# Altium schematic sheet CC_amplifier.SchDoc
size A4; SheetNumber: 2; SheetTotal: 12
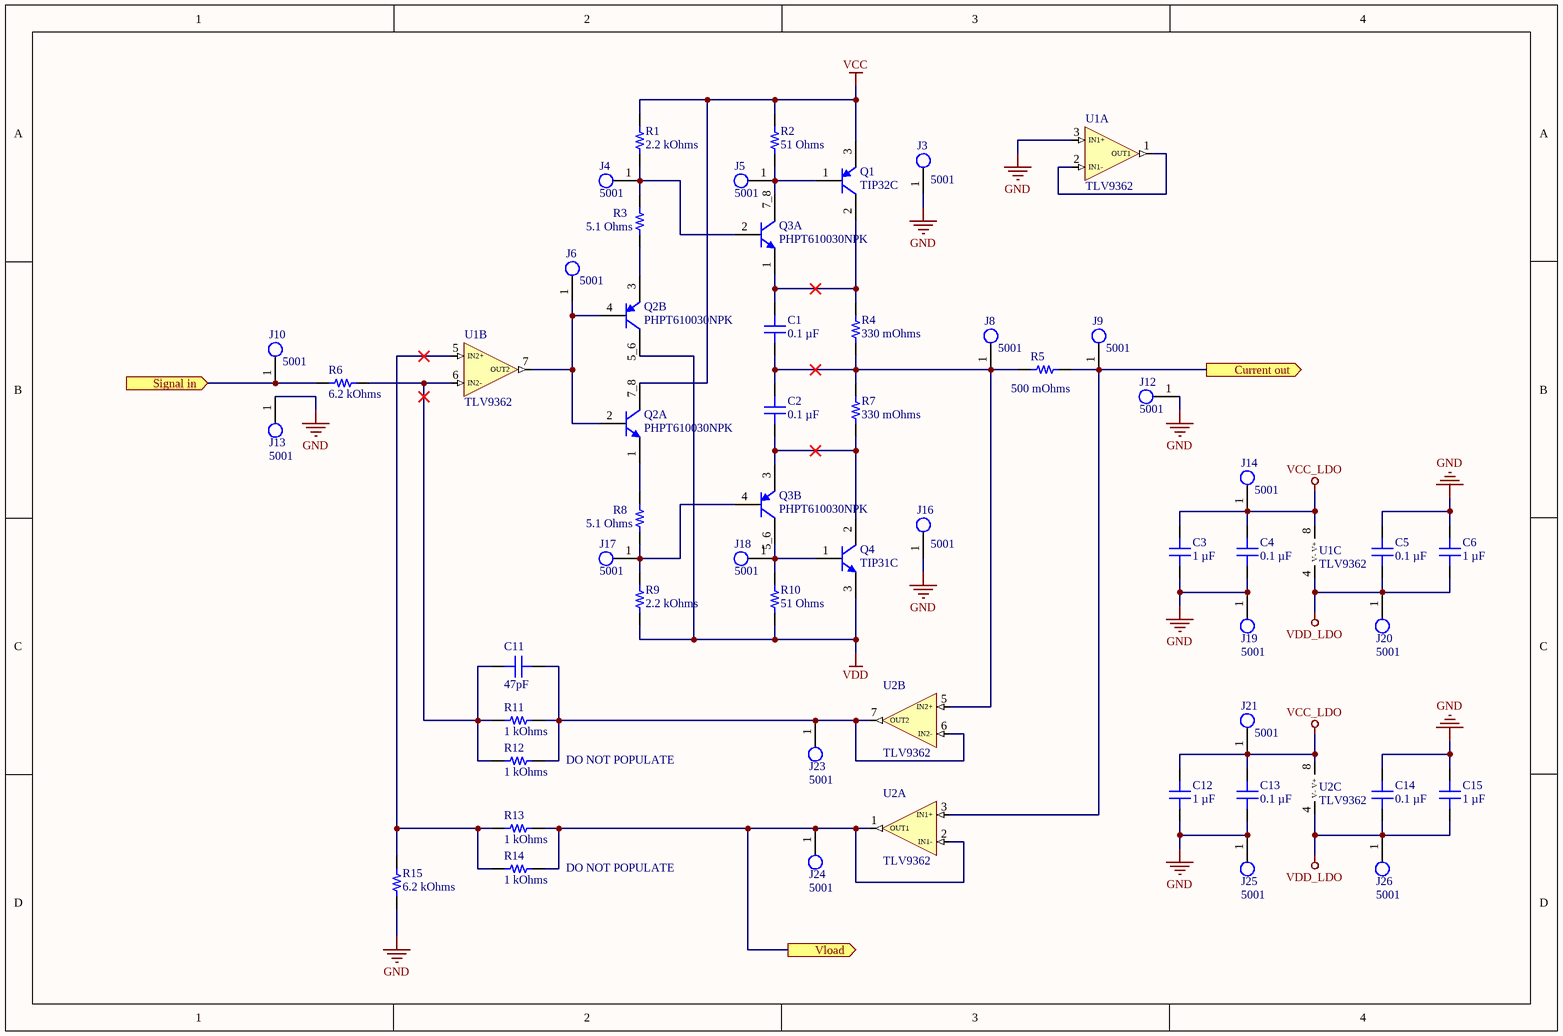
[diagram p0: CC_amplifier.SchDoc]

## Parts
C1  0.1 µF  [CAP 1206_3216 - 0.8MM]
C2  0.1 µF  [CAP 1206_3216 - 0.8MM]
C3  1 µF  [CAP 1206_3216 - 0.8MM]
C4  0.1 µF  [CAP 1206_3216 - 0.8MM]
C5  0.1 µF  [CAP 1206_3216 - 0.8MM]
C6  1 µF  [CAP 1206_3216 - 0.8MM]
C11  47pF  [CAP 1206_3216 - 1.8MM]
C12  1 µF  [CAP 1206_3216 - 0.8MM]
C13  0.1 µF  [CAP 1206_3216 - 0.8MM]
C14  0.1 µF  [CAP 1206_3216 - 0.8MM]
C15  1 µF  [CAP 1206_3216 - 0.8MM]
J3  5001  [FP-5001-MFG]
J4  5001  [FP-5001-MFG]
J5  5001  [FP-5001-MFG]
J6  5001  [FP-5001-MFG]
J8  5001  [FP-5001-MFG]
J9  5001  [FP-5001-MFG]
J10  5001  [FP-5001-MFG]
J12  5001  [FP-5001-MFG]
J13  5001  [FP-5001-MFG]
J14  5001  [FP-5001-MFG]
J16  5001  [FP-5001-MFG]
J17  5001  [FP-5001-MFG]
J18  5001  [FP-5001-MFG]
J19  5001  [FP-5001-MFG]
J20  5001  [FP-5001-MFG]
J21  5001  [FP-5001-MFG]
J23  5001  [FP-5001-MFG]
J24  5001  [FP-5001-MFG]
J25  5001  [FP-5001-MFG]
J26  5001  [FP-5001-MFG]
Q1  TIP32C  [ONSC-TO-220-3-221A-09]
Q2  PHPT610030NPK  [TRANS_BUK9K18-40E,115]  (parts A,B of 2)
Q3  PHPT610030NPK  [TRANS_BUK9K18-40E,115]  (parts A,B of 2)
Q4  TIP31C  [ONSC-TO-220-3-221A-09]
R1  2.2 kOhms  [RES 1206_3216]
R2  51 Ohms  [RES 1206_3216]
R3  5.1 Ohms  [RES 1206_3216]
R4  330 mOhms  [STACKPOLE CSR2512]
R5  500 mOhms  [STACKPOLE CSR2512]
R6  6.2 kOhms  [RES 1206_3216]
R7  330 mOhms  [STACKPOLE CSR2512]
R8  5.1 Ohms  [RES 1206_3216]
R9  2.2 kOhms  [RES 1206_3216]
R10  51 Ohms  [RES 1206_3216]
R11  1 kOhms  [RES 1206_3216]
R12  1 kOhms  [RES 1206_3216]
R13  1 kOhms  [RES 1206_3216]
R14  1 kOhms  [RES 1206_3216]
R15  6.2 kOhms  [RES 1206_3216]
U1  TLV9362  [SOIC8-127P600X175-8N]  (parts A,B,C of 3)
U2  TLV9362  [SOIC8-127P600X175-8N]  (parts A,B,C of 3)

## Ports
Current out (out), Signal in (in), Vload (out)

## Nets
GND: C3.1 C4.1 C5.2 C6.2 C12.1 C13.1 C14.2 C15.2 J3.1 J12.1 J13.1 J16.1 J19.1 J25.1 R15.1 U1.3(IN1+)
VCC: Q1.3(E) Q2.7_8(C1) R1.2 R2.2
VCC_LDO: C3.2 C4.2 C12.2 C13.2 J14.1 J21.1 U1.8(V+) U2.8(V+)
VDD: Q2.5_6(C2) Q4.3(E) R9.1 R10.1
VDD_LDO: C5.1 C6.1 C14.1 C15.1 J20.1 J26.1 U1.4(V-) U2.4(V-)
Current out: J9.1 R5.1 U2.3(IN1+) ; port Current out
Signal in: J10.1 R6.2 ; port Signal in
Vload: J24.1 R13.2 R14.2 U2.1(OUT1) U2.2(IN1-) ; port Vload
NetC1_1: C1.1 C2.2 J8.1 R4.1 R5.2 R7.2 U2.5(IN2+)
NetC1_2: C1.2 Q1.2(C) Q3.1(E1) R4.2
NetC2_1: C2.1 Q3.3(E2) Q4.2(C) R7.1
NetC11_1: C11.1 R6.1 R11.1 R12.1 U1.6(IN2-)
NetC11_2: C11.2 J23.1 R11.2 R12.2 U2.6(IN2-) U2.7(OUT2)
NetJ4_1: J4.1 Q3.2(B1) R1.1 R3.2
NetJ5_1: J5.1 Q1.1(B) Q3.7_8(C1) R2.1
NetJ6_1: J6.1 Q2.2(B1) Q2.4(B2) U1.7(OUT2)
NetJ17_1: J17.1 Q3.4(B2) R8.1 R9.2
NetJ18_1: J18.1 Q3.5_6(C2) Q4.1(B) R10.2
NetQ2_1: Q2.1(E1) R8.2
NetQ2_3: Q2.3(E2) R3.1
NetR13_1: R13.1 R14.1 R15.2 U1.5(IN2+)
NetU1_1: U1.1(OUT1) U1.2(IN1-)

## Notes on the sheet
- DO NOT POPULATE

## Library data of the parts
C1 C2 C4 C5 C13 C14 = 885012208087: CAP CER 0.1UF 50V X7R 1206; manufacturer: Würth Elektronik; Tolerance: ±10%; Part Number: 885012208087; Capacitance: 0.1 µF; Applications: General Purpose; componentlink1description: Datasheet; componentlink1url: https://katalog.we-online.de/pbs/datasheet/885012208087.pdf; componentlink2description: DigiKey Link; componentlink2url: https://www.digikey.com/en/products/detail/würth-elektronik/885012208087/5453982; Device Package: 1206 (3216 Metric); lastupdated: 6/4/2024 19:10:27; Lifecycle Status: Active; Minimum Order: 1; Mounting Type: Surface Mount, MLCC; Operating Temperature: -55°C ~ 125°C; Package / Case: 1206 (3216 Metric); packaging: TapeAndReel; partid: 20879; Part Status: Active; price: 0.06; series: WCAP-CSGP; Size / Dimension: 0.126" L x 0.063" W (3.20mm x 1.60mm); Supplier 1: DigiKey; Supplier Part Number 1: 732-8127-1-ND; Temperature Coefficient: X7R; Thickness (Max): 0.035" (0.90mm); value: 0.1 µF; Voltage - Rated: 50V
C3 C6 C12 C15 = 885012208093: CAP CER 1UF 50V X7R 1206; manufacturer: Würth Elektronik; Tolerance: ±10%; Part Number: 885012208093; Capacitance: 1 µF; Applications: General Purpose; componentlink1description: Datasheet; componentlink1url: https://katalog.we-online.de/pbs/datasheet/885012208093.pdf; componentlink2description: DigiKey Link; componentlink2url: https://www.digikey.com/en/products/detail/würth-elektronik/885012208093/5453432; Device Package: 1206 (3216 Metric); lastupdated: 6/4/2024 19:10:33; Lifecycle Status: Active; Minimum Order: 1; Mounting Type: Surface Mount, MLCC; Operating Temperature: -55°C ~ 125°C; Package / Case: 1206 (3216 Metric); packaging: TapeAndReel; partid: 39665; Part Status: Active; price: 0.10; series: WCAP-CSGP; Size / Dimension: 0.126" L x 0.063" W (3.20mm x 1.60mm); Supplier 1: DigiKey; Supplier Part Number 1: 732-7577-1-ND; Temperature Coefficient: X7R; Thickness (Max): 0.075" (1.90mm); value: 1 µF; Voltage - Rated: 50V
C11 = 1206AA470KAT1A: CAP CER 47PF 1KV C0G/NP0 1206; manufacturer: AVX Corporation; Temperature Coefficient: C0G, NP0; Tolerance: ±10%; Voltage - Rated: 1000V (1kV); Part Number: 1206AA470KAT1A; Capacitance: 47pF; Applications: General Purpose; componentlink1description: Datasheet; componentlink1url: http://datasheets.avx.com/AVX-HV_MLCC.pdf; componentlink2description: DigiKey Link; componentlink2url: http://digikey.com/product-detail/en/avx-corporation/1206AA470KAT1A/478-2949-1-ND/808148; Device Package: 1206 (3216 Metric); Features: High Voltage; lastupdated: 9/2/2020 01:05:31; Lifecycle Status: Active; Minimum Order: 1; Mounting Type: Surface Mount, MLCC; Operating Temperature: -55°C ~ 125°C; Package / Case: 1206 (3216 Metric); packaging: TapeAndReel; partid: 21825; Part Status: Active; price: 0.11; series: -; Size / Dimension: 0.130" L x 0.063" W (3.30mm x 1.60mm); Supplier 1: DigiKey; Supplier Part Number 1: 478-2949-1-ND; Thickness (Max): 0.071" (1.80mm); value: 47pF
J3-J6 J8-J10 J12-J14 J16-J21 J23-J26 = CMP-2000-05181-2: PC TEST POINT MINIATURE BLACK; Body Material: Bronze; Plating: Silver; Inside Diameter: 1.27mm; Hole Diameter: 1.6mm; Number of Ports: 1; Outside Diameter: 2.54mm; Insulation: Insulated; Insulation Material: Nylon; Mount: Through Hole; RoHS Compliant: Yes; Series: THM; Height: 0.3inch; Termination: Through Hole; Material: Nylon; Packaging: Bulk; Contact Material: Bronze; REACH SVHC: No SVHC; Contact Plating: Silver; Orientation: Straight; Lead Free: Lead Free; Package Quantity: 100; Length: 7.62mm; Flammability Rating: UL94 V-0; Number of Contacts: 1; Diameter: 2.54mm; Housing Color: Black; Color: Black
Q1 = TIP32C: Complementary Silicon Plastic Power Transistor, 3-Pin TO-220, Tube; Manufacturer: On Semiconductor; fT Min (MHz): 3; Polarity: PNP; DatasheetVersion: Rev. 14; PackageVersion: Rev. AG, 09/2011; PackageReference: TO-220-3-221A-09; PackageDescription: 3-Pin Flange Mount, Vertical Straight Lead, Body 9.97 x 4.445 mm, Pitch 2.54 mm; Supplier 1: Digi-Key; Supplier Part Number 1: TIP32COS-ND; IC Continuous (A): 3; Packing: Tube; RoHS: FALSE; Mounting Technology: Through Hole; PartNumber: TIP32C; ComponentLink1Description: Manufacturer URL; ComponentLink1URL: http://www.onsemi.com/; ComponentLink2Description: Datasheet; ComponentLink2URL: http://www.onsemi.com/pub_link/Collateral/TIP31A-D.PDF; ComponentLink3Description: Package Specification; ComponentLink3URL: http://www.onsemi.com/pub_link/Collateral/221A-09.PDF
Q4 = TIP31C: Complementary Silicon Plastic Power Transistor, 3-Pin TO-220, Tube; Manufacturer: On Semiconductor; fT Min (MHz): 3; Polarity: NPN; DatasheetVersion: Rev. 14; PackageVersion: Rev. AG, 09/2011; PackageReference: TO-220-3-221A-09; PackageDescription: 3-Pin Flange Mount, Vertical Straight Lead, Body 9.97 x 4.445 mm, Pitch 2.54 mm; Supplier 1: Digi-Key; Supplier Part Number 1: TIP31COS-ND; IC Continuous (A): 3; Packing: Tube; RoHS: FALSE; Mounting Technology: Through Hole; PartNumber: TIP31C; ComponentLink1Description: Manufacturer URL; ComponentLink1URL: http://www.onsemi.com/; ComponentLink2Description: Datasheet; ComponentLink2URL: http://www.onsemi.com/pub_link/Collateral/TIP31A-D.PDF; ComponentLink3Description: Package Specification; ComponentLink3URL: http://www.onsemi.com/pub_link/Collateral/221A-09.PDF
R1 R9 = ERJ-8GEYJ222V: RES SMD 2.2K OHM 5% 1/4W 1206; Manufacturer: Panasonic Electronic Components; Power (Watts): 0.25W, 1/4W; Temperature Coefficient: ±200ppm/°C; Part Number: ERJ-8GEYJ222V; ComponentLink1Description: Datasheet; ComponentLink1URL: http://industrial.panasonic.com/www-cgi/jvcr13pz.cgi?E+PZ+3+AOA0001+ERJ8GEYJ222V+7+WW; ComponentLink2Description: DigiKey Link; ComponentLink2URL: https://www.digikey.com/en/products/detail/panasonic-electronic-components/ERJ-8GEYJ222V/10357; Composition: Thick Film; Device Package: 1206 (3216 Metric); Features: Automotive AEC-Q200; Height - Seated (Max): 0.028" (0.70mm); LastUpdated: 2/9/2024 20:54:10; Lifecycle Status: Active; Minimum Order: 1; Number of Terminations: 2; Operating Temperature: -55°C ~ 155°C; Package / Case: 1206 (3216 Metric); Packaging: TapeAndReel; PartId: 35911; Part Status: Active; Price: 0.02; Ratings: AEC-Q200; Resistance: 2.2 kOhms; Series: ERJ-8G; Size / Dimension: 0.126" L x 0.063" W (3.20mm x 1.60mm); Supplier 1: DigiKey; Supplier Part Number 1: P2.2KECT-ND; Supplier Device Package: 1206; Tolerance: ±5%; Value: 2.2 kOhms
R2 R10 = ERJ-8GEYJ510V: RES SMD 51 OHM 5% 1/4W 1206; Manufacturer: Panasonic Electronic Components; Power (Watts): 0.25W, 1/4W; Temperature Coefficient: ±200ppm/°C; Part Number: ERJ-8GEYJ510V; ComponentLink1Description: Datasheet; ComponentLink1URL: http://industrial.panasonic.com/www-cgi/jvcr13pz.cgi?E+PZ+3+AOA0001+ERJ8GEYJ510V+7+WW; ComponentLink2Description: DigiKey Link; ComponentLink2URL: https://www.digikey.com/en/products/detail/panasonic-electronic-components/ERJ-8GEYJ510V/11678; Composition: Thick Film; Device Package: 1206 (3216 Metric); Features: Automotive AEC-Q200; Height - Seated (Max): 0.028" (0.70mm); LastUpdated: 2/9/2024 20:54:16; Lifecycle Status: Active; Minimum Order: 1; Number of Terminations: 2; Operating Temperature: -55°C ~ 155°C; Package / Case: 1206 (3216 Metric); Packaging: TapeAndReel; PartId: 34147; Part Status: Active; Price: 0.02; Ratings: AEC-Q200; Resistance: 51 Ohms; Series: ERJ-8G; Size / Dimension: 0.126" L x 0.063" W (3.20mm x 1.60mm); Supplier 1: DigiKey; Supplier Part Number 1: P51ECT-ND; Supplier Device Package: 1206; Tolerance: ±5%; Value: 51 Ohms
R3 R8 = ERJ-8GEYJ5R1V: RES SMD 5.1 OHM 5% 1/4W 1206; Manufacturer: Panasonic Electronic Components; Power (Watts): 0.25W, 1/4W; Temperature Coefficient: -100/ +600ppm/°C; Part Number: ERJ-8GEYJ5R1V; ComponentLink1Description: Datasheet; ComponentLink1URL: http://industrial.panasonic.com/www-cgi/jvcr13pz.cgi?E+PZ+3+AOA0001+ERJ8GEYJ5R1V+7+WW; ComponentLink2Description: DigiKey Link; ComponentLink2URL: https://www.digikey.com/en/products/detail/panasonic-electronic-components/ERJ-8GEYJ5R1V/282211; Composition: Thick Film; Device Package: 1206 (3216 Metric); Features: Automotive AEC-Q200; Height - Seated (Max): 0.028" (0.70mm); LastUpdated: 2/9/2024 20:54:09; Lifecycle Status: Active; Minimum Order: 1; Number of Terminations: 2; Operating Temperature: -55°C ~ 155°C; Package / Case: 1206 (3216 Metric); Packaging: TapeAndReel; PartId: 36042; Part Status: Active; Price: 0.02; Ratings: AEC-Q200; Resistance: 5.1 Ohms; Series: ERJ-8G; Size / Dimension: 0.126" L x 0.063" W (3.20mm x 1.60mm); Supplier 1: DigiKey; Supplier Part Number 1: P5.1ECT-ND; Supplier Device Package: 1206; Tolerance: ±5%; Value: 5.1 Ohms
R4 R7 = CSRN2512FKR330: RES 0.33 OHM 1% 2W 2512; Manufacturer: Stackpole Electronics Inc; Temperature Coefficient: ±200ppm/°C; Part Number: CSRN2512FKR330; Package / Case: 2512 (6432 Metric); ComponentLink1Description: Datasheet; ComponentLink1URL: https://www.seielect.com/catalog/sei-csr_csrn.pdf; ComponentLink2Description: DigiKey Link; ComponentLink2URL: https://www.digikey.com/en/products/detail/stackpole-electronics-inc/CSRN2512FKR330/1742756; Composition: Thick Film; Device Package: 2512 (6432 Metric); Features: Current Sense; Height - Seated (Max): 0.028" (0.70mm); LastUpdated: 2/17/2022 18:43:57; Lifecycle Status: Active; Minimum Order: 1; Number of Terminations: 2; Operating Temperature: -55°C ~ 155°C; Packaging: TapeAndReel; PartId: 1770; Part Status: Active; Power (Watts): 2W; Price: 0.12; Resistance: 330 mOhms; Series: CSRN; Size / Dimension: 0.250" L x 0.124" W (6.35mm x 3.15mm); Supplier 1: DigiKey; Supplier Part Number 1: CSRN2512FKR330CT-ND; Supplier Device Package: 2512; Tolerance: ±1%; Value: 330 mOhms
R5 = CSRN2512FKR500: RES 0.5 OHM 1% 2W 2512; Manufacturer: Stackpole Electronics Inc; Temperature Coefficient: ±200ppm/°C; Part Number: CSRN2512FKR500; Package / Case: 2512 (6432 Metric); ComponentLink1Description: Datasheet; ComponentLink1URL: https://www.seielect.com/catalog/sei-csr_csrn.pdf; ComponentLink2Description: DigiKey Link; ComponentLink2URL: https://www.digikey.com/en/products/detail/stackpole-electronics-inc/CSRN2512FKR500/1742768; Composition: Thick Film; Device Package: 2512 (6432 Metric); Features: Current Sense; Height - Seated (Max): 0.028" (0.70mm); LastUpdated: 2/17/2022 18:43:58; Lifecycle Status: Active; Minimum Order: 1; Number of Terminations: 2; Operating Temperature: -55°C ~ 155°C; Packaging: TapeAndReel; PartId: 1683; Part Status: Active; Power (Watts): 2W; Price: 0.07; Resistance: 500 mOhms; Series: CSRN; Size / Dimension: 0.250" L x 0.124" W (6.35mm x 3.15mm); Supplier 1: DigiKey; Supplier Part Number 1: CSRN2512FKR500CT-ND; Supplier Device Package: 2512; Tolerance: ±1%; Value: 500 mOhms
R6 R15 = ERA-8AEB622V: RES SMD 6.2K OHM 0.1% 1/4W 1206; Manufacturer: Panasonic Electronic Components; Power (Watts): 0.25W, 1/4W; Temperature Coefficient: ±25ppm/°C; Part Number: ERA-8AEB622V; ComponentLink1Description: Datasheet; ComponentLink1URL: https://industrial.panasonic.com/cdbs/www-data/pdf/RDM0000/AOA0000C307.pdf; ComponentLink2Description: DigiKey Link; ComponentLink2URL: https://www.digikey.com/en/products/detail/panasonic-electronic-components/ERA-8AEB622V/3071119; Composition: Thin Film; Device Package: 1206 (3216 Metric); Features: Automotive AEC-Q200; Height - Seated (Max): 0.028" (0.70mm); LastUpdated: 2/9/2024 20:54:11; Lifecycle Status: Active; Minimum Order: 1; Number of Terminations: 2; Operating Temperature: -55°C ~ 155°C; Package / Case: 1206 (3216 Metric); Packaging: TapeAndReel; PartId: 35569; Part Status: Active; Price: 0.10; Ratings: AEC-Q200; Resistance: 6.2 kOhms; Series: ERA-8A; Size / Dimension: 0.126" L x 0.063" W (3.20mm x 1.60mm); Supplier 1: DigiKey; Supplier Part Number 1: 10-ERA-8AEB622VCT-ND; Supplier Device Package: 1206; Tolerance: ±0.1%; Value: 6.2 kOhms
R11-R14 = ERA-8AEB102V: RES SMD 1K OHM 0.1% 1/4W 1206; Manufacturer: Panasonic Electronic Components; Power (Watts): 0.25W, 1/4W; Temperature Coefficient: ±25ppm/°C; Part Number: ERA-8AEB102V; ComponentLink1Description: Datasheet; ComponentLink1URL: https://industrial.panasonic.com/cdbs/www-data/pdf/RDM0000/AOA0000C307.pdf; ComponentLink2Description: DigiKey Link; ComponentLink2URL: https://www.digikey.com/en/products/detail/panasonic-electronic-components/ERA-8AEB102V/3070741; Composition: Thin Film; Device Package: 1206 (3216 Metric); Features: Automotive AEC-Q200; Height - Seated (Max): 0.028" (0.70mm); LastUpdated: 2/9/2024 20:54:17; Lifecycle Status: Active; Minimum Order: 1; Number of Terminations: 2; Operating Temperature: -55°C ~ 155°C; Package / Case: 1206 (3216 Metric); Packaging: TapeAndReel; PartId: 33986; Part Status: Active; Price: 0.10; Ratings: AEC-Q200; Resistance: 1 kOhms; Series: ERA-8A; Size / Dimension: 0.126" L x 0.063" W (3.20mm x 1.60mm); Supplier 1: DigiKey; Supplier Part Number 1: P1.0KBCCT-ND; Supplier Device Package: 1206; Tolerance: ±0.1%; Value: 1 kOhms
U1 U2 = TLV9362: TLV936x 10-MHz, 40-V, RRO, Operational Amplifie; ComponentLink1Description: Datasheet; ComponentLink1URL: https://www.ti.com/lit/ds/symlink/tlv9362.pdf
Q2 Q3 = PHPT610030NPK: ComponentLink1Description: Datasheet; ComponentLink1URL: https://assets.nexperia.com/documents/data-sheet/PHPT610030NPK.pdf; ComponentLink2Description: Supplier; ComponentLink2URL: https://hr.mouser.com/ProductDetail/Nexperia/PHPT610030NPKX?qs=%252BRKXB2WKlSeoXKhT5DAScw%3D%3D